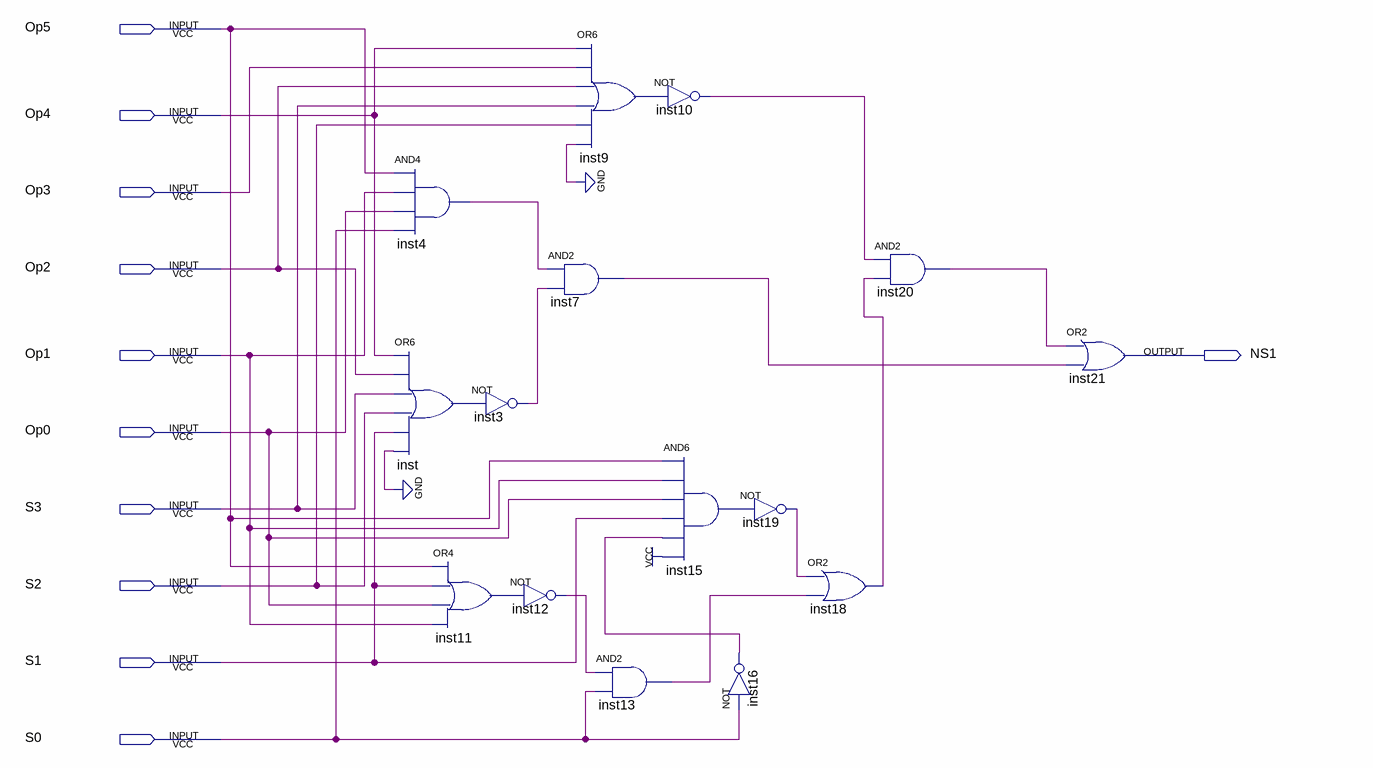
[diagram p0: schematic sheet]
// Quartus schematic NS1.bdf as structural Verilog: 15 symbols, 11 pins
module NS1 (
  input  Op5,
  input  Op4,
  input  Op3,
  input  Op2,
  input  Op1,
  input  Op0,
  input  S3,
  input  S2,
  input  S1,
  input  S0,
  output NS1
);

  wire inst3_out, inst4_out, inst7_out, inst9_out, inst10_out, inst11_out, inst12_out, inst13_out,
       inst15_out, inst16_out, inst18_out, inst19_out, inst20_out, inst_out;

  and inst4 (inst4_out, Op5, Op1, Op0, S0);
  or inst (inst_out, Op4, Op2, S3, S2, S1, 1'b0);
  or inst11 (inst11_out, Op5, S1, Op0, Op1);
  not inst3 (inst3_out, inst_out);
  not inst12 (inst12_out, inst11_out);
  or inst9 (inst9_out, Op4, Op3, Op2, S3, S2, 1'b0);
  and inst7 (inst7_out, inst4_out, inst3_out);
  and inst13 (inst13_out, inst12_out, S0);
  not inst10 (inst10_out, inst9_out);
  and inst15 (inst15_out, Op5, Op1, Op0, S1, inst16_out, 1'b1);
  not inst19 (inst19_out, inst15_out);
  not inst16 (inst16_out, S0);
  or inst18 (inst18_out, inst19_out, inst13_out);
  and inst20 (inst20_out, inst10_out, inst18_out);
  or inst21 (NS1, inst20_out, inst7_out);
endmodule
